# Altium schematic sheet SHDN-CURRENT-S12-V00-Buzzer.SchDoc: Alarm Buzzer (4kHz)
size A3; DrawnBy: Jonn Dillon; DocumentNumber: 12; SheetNumber: 12; SheetTotal: 14; Project: Shutdown Current Board 2020
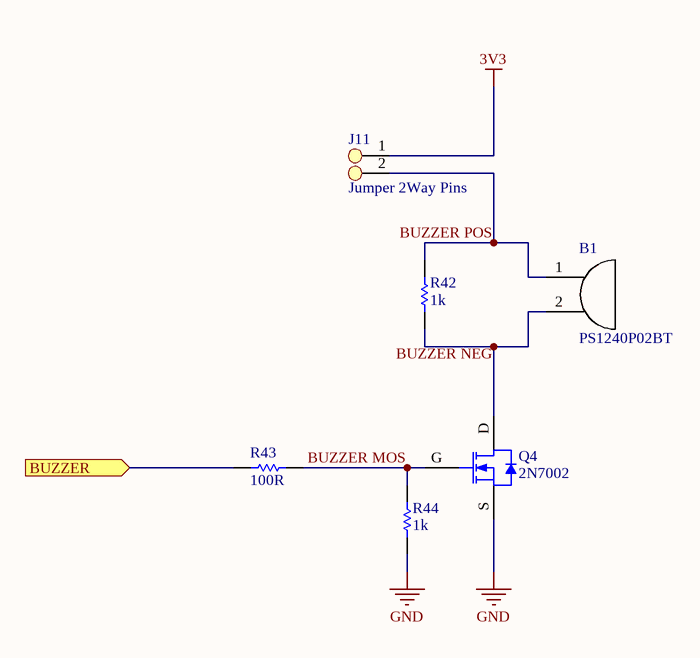
[diagram p0: SHDN-CURRENT-S12-V00-Buzzer.SchDoc]

## Parts
B1  PS1240P02BT  [PS1240P02BT]
J11  Jumper 2Way Pins  [Jumper_2Way_Pin]
Q4  2N7002  [SOT23-3]
R42  1k  [Res_ThinFilm_0603]
R43  100R  [Res_ThinFilm_0603]
R44  1k  [Res_ThinFilm_0603]

## Ports
BUZZER (in)

## Nets
3V3: J11.1
GND: Q4.S R44.2
BUZZER: R43.1 ; port BUZZER
BUZZER MOS: Q4.G R43.2 R44.1
BUZZER NEG: B1.2 Q4.D R42.1
BUZZER POS: B1.1 J11.2 R42.2

## Notes on the sheet
- Revision History:
- Sheet Title:
- Rev
- Date
- Description
- Project:
- Size:
- Drawn By:
- A3
- Number:
- Revision:
- Sheet
- Version:
- of
- QUT Motorsport
- O-120, Gardens Point
- 2 George Street
- Brisbane, QLD 4000
- Australia
- Print Date:
- Print Time:
- File Name:

## Library data of the parts
B1 = PS1240P02BT: Buzzers Transducer, Externally Driven Piezo 3V 4kHz 60dB @ 3V, 10cm Through Hole PC Pins
J11 = Jumper 2Way Side Pins
R42 R44 = 1k 5% 0603: Resistor, SMD, 1k, 0.1W, 5%, 0603
R43 = 100R 5%, 0603: Resistor, SMD, 100R, 0.1W, 5%, 0603